# EAGLE design freebus_kopplerplatine (EAGLE 4.16)
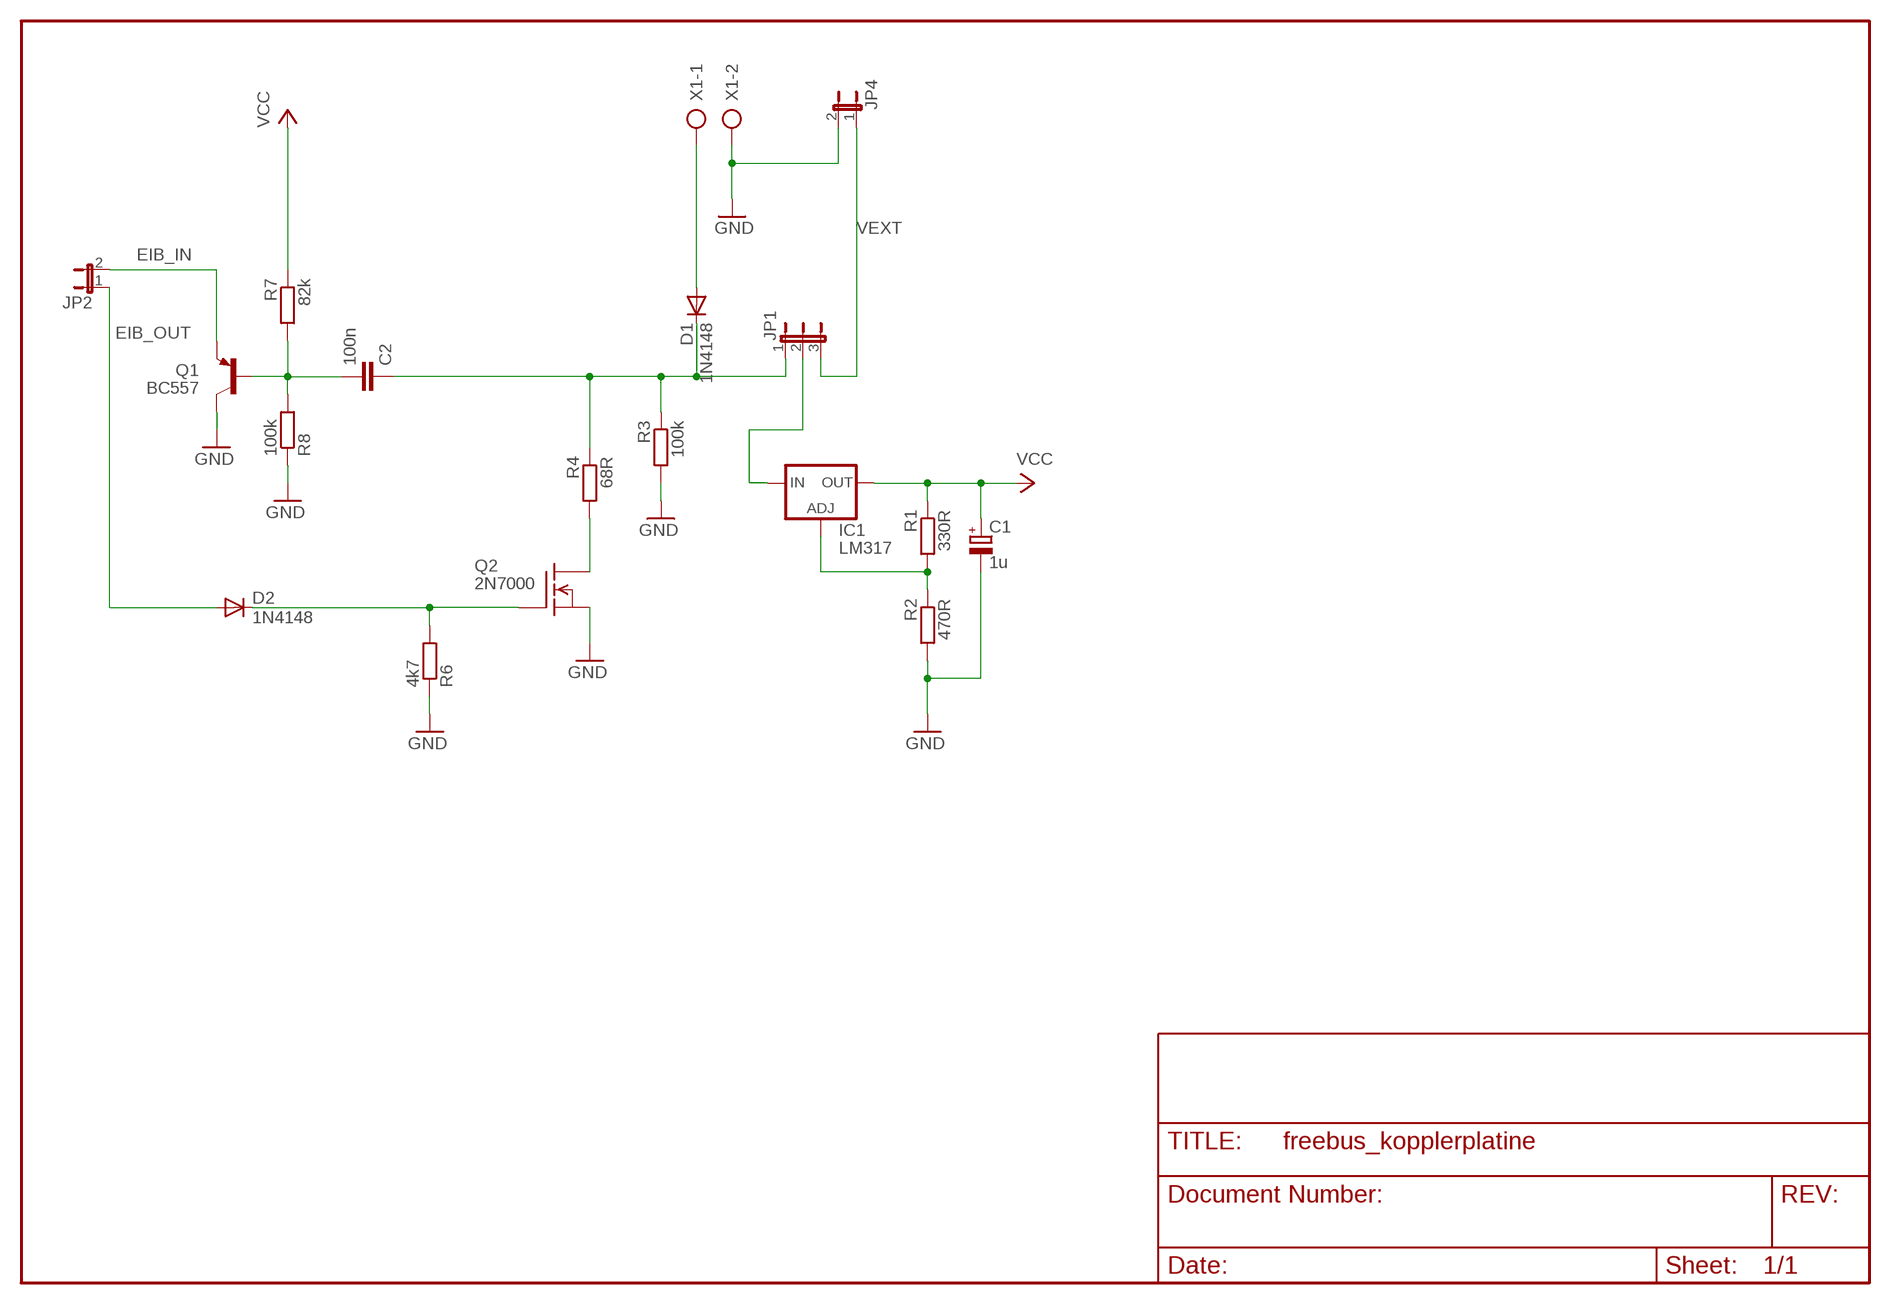
[diagram p0: schematic, sheet 1]

## Parts
C1  1u  CPOL-EUE2-5  [E2-5]
C2  100n  C-EU050-025X075  [C050-025X075]
D1  1N4148  [DO35-10]
D2  1N4148  [DO35-10]
IC1  LM317  LM317L  [317L]
JP1  JP2E  [JP2]
JP2  JP1E  [JP1]
JP4  JP1E  [JP1]
Q1  BC557  [TO92]
Q2  2N7000  VN2222KM  [TO237]
R1  330R  R-EU_0207/10  [0207/10]
R2  470R  R-EU_0207/10  [0207/10]
R3  100k  R-EU_0207/10  [0207/10]
R4  68R  R-EU_0207/10  [0207/10]
R6  4k7  R-EU_0207/10  [0207/10]
R7  82k  R-EU_0207/10  [0207/10]
R8  100k  R-EU_0207/10  [0207/10]
X1  AK500/2  [AK500/2]

## Nets
EIB_IN: JP2.2 Q1.1(E)
EIB_OUT: D2.A JP2.1
GND: C1.- JP4.2 Q1.3(C) Q2.3(S) R2.2 R3.2 R6.1 R8.1 X1.2
N$1: D2.C Q2.2(G) R6.2
N$2: IC1.1(ADJ) R1.2 R2.1
N$3 [supply]: C2.1 D1.C JP1.1 R3.1 R4.1
N$4: D1.A X1.1
N$5 [supply]: Q2.1(D) R4.2
N$6 [supply]: IC1.3(IN) JP1.2
N$7 [supply]: C2.2 Q1.2(B) R7.2 R8.2
VCC: C1.+ IC1.2(OUT) R1.1 R7.1
VEXT [supply]: JP1.3 JP4.1

## Library data of the parts
C1 = rcl:CPOL-EU: POLARIZED CAPACITOR, European symbol
C2 = rcl:C-EU: CAPACITOR, European symbol
D1 D2 = diode:1N4148: DIODE high speed (Philips)
IC1 = v-reg:LM317L: VOLTAGE REGULATOR
JP1 = jumper:JP2E: JUMPER
JP2 JP4 = jumper:JP1E: JUMPER
Q1 = transistor-pnp:BC557: PNP Transistor
Q2 = transistor-fet:VN2222KM: N-Channel Enhancement MOSFET (VMOS); 60V; 0,5A; 7,5Ohm
R1-R4 R6-R8 = rcl:R-EU_: RESISTOR, European symbol
X1 = con-ptr500:AK500/2: CONNECTOR

## Net classes
0 default: width 0.406 mm
1 supply: width 0.406 mm

## Board
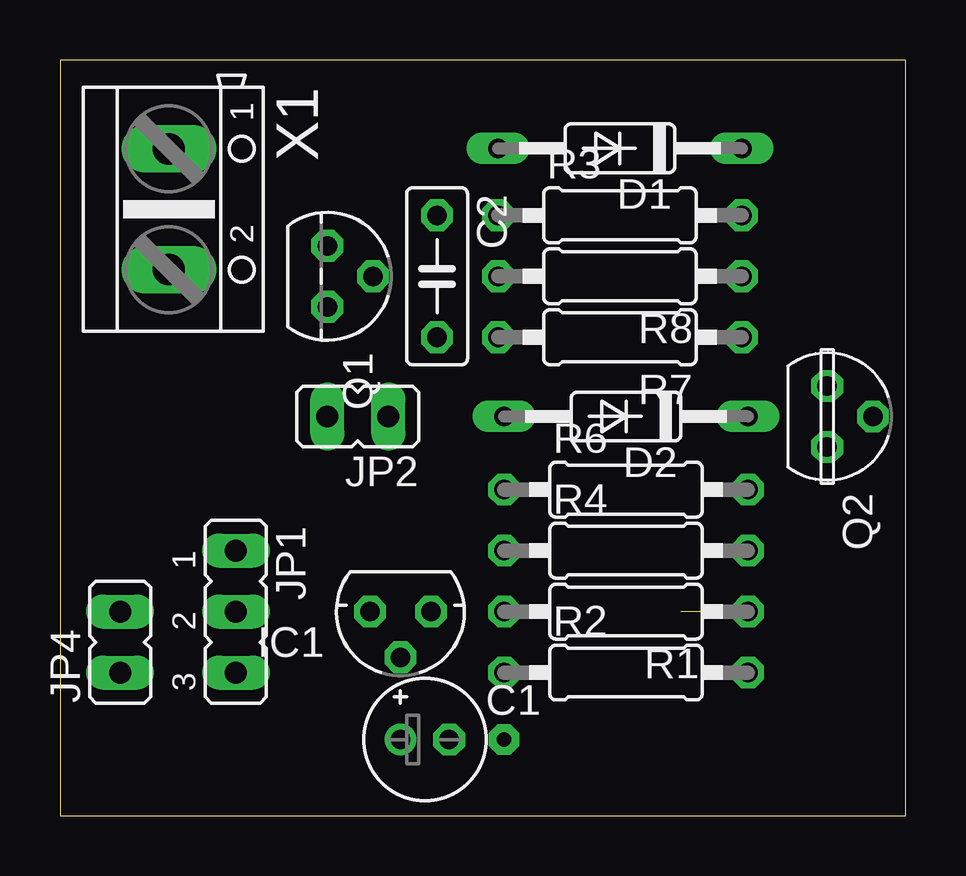
[diagram p1: board, top side]
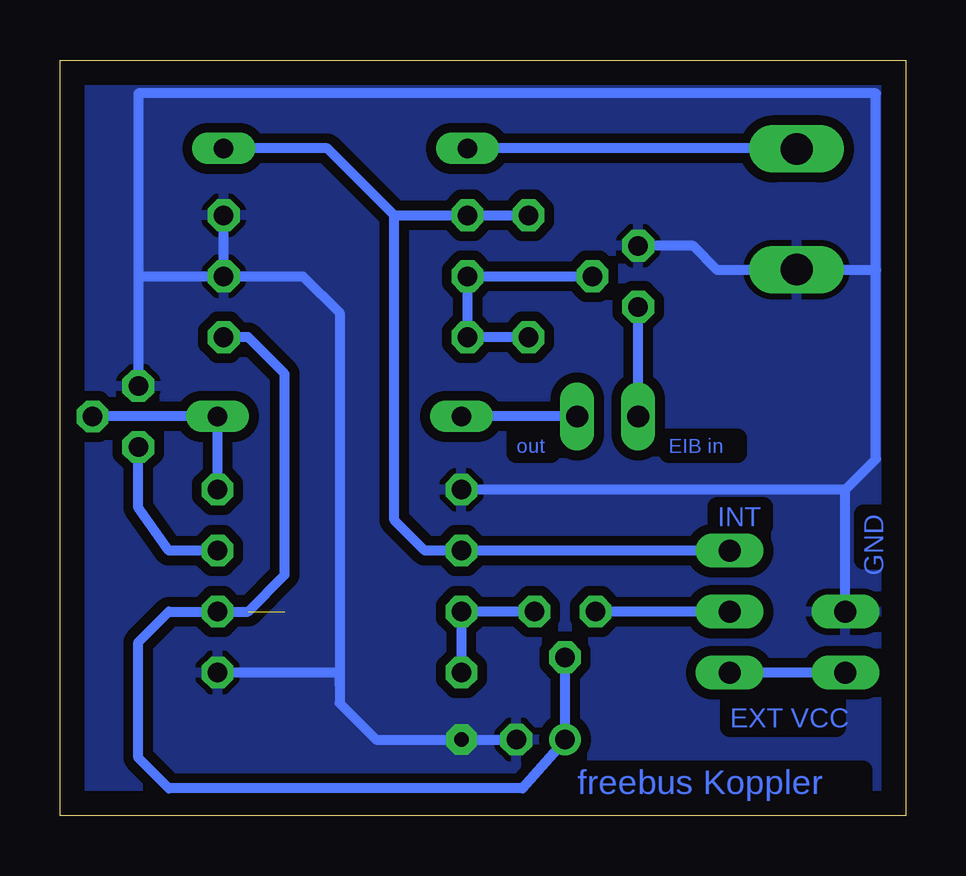
[diagram p2: board, bottom side, seen from below]

Size 35.23 x 31.49 mm. Coordinates in mm from the lower left corner, seen from the top.
Outline: 0,0 35.23,0 35.23,31.49 0,31.49 0,0
Copper layers (1*16): Top 0.035mm / dielectric 1.5mm / Bottom 0.035mm
Design rules "default": minimum track width 10mil, minimum drill 24mil, track to track 16mil, track to pad 16mil, pad to pad 16mil, via to via 8mil, smd to smd 8mil, copper to edge 40mil, drill to drill 8mil, minimum pad ring 10mil, minimum via ring 8mil, stop-mask expansion 4mil, vias tented up to drill 0mil, thermal gap 10mil

### Footprints (pad centres in the part's own frame; a part is rotated, then mirrored left to right if it is on the bottom)
E2-5 = drill 0.813 pad 1.27 round: + -1.016,0 | drill 0.813 pad 1.27 octagon: - 1.016,0
C050-025X075 = drill 0.813 octagon: 1 -2.54,0; 2 2.54,0
DO35-10 = drill 0.813 long: A 5.08,0; C -5.08,0
317L = drill 0.813 octagon: 1 -1.27,0; 2 0,1.905; 3 1.27,0
JP2 = drill 0.914 long: 1 -2.54,0; 2 0,0; 3 2.54,0
JP1 = drill 0.914 long: 1 0,-1.27; 2 0,1.27
TO92 = drill 0.813 octagon: 1 1.27,0; 2 0,1.905; 3 -1.27,0
TO237 = drill 0.813 octagon: 1 1.27,0; 2 0,1.905; 3 -1.27,0
0207/10 = drill 0.813 octagon: 1 -5.08,0; 2 5.08,0
AK500/2 = drill 1.321 long: 1 -2.515,0; 2 2.515,0

### Placement (x,y rotation side)
C1  15.2,3.17 0 top
C2  15.71,22.47 270 top
D1  23.33,27.81 180 top
D2  23.58,16.63 180 top
IC1  14.19,8.5 180 top
JP1  7.33,8.5 270 top
JP2  12.41,16.63 90 top
JP4  2.5,7.23 0 top
Q1  11.14,22.47 270 top
Q2  31.97,16.63 270 top
R1  23.58,8.5 180 top
R2  23.58,5.96 0 top
R3  23.33,25.01 0 top
R4  23.58,11.04 0 top
R6  23.58,13.58 0 top
R7  23.33,19.93 180 top
R8  23.33,22.47 180 top
X1  4.53,25.27 270 top

### Tracks (layer width: path | path; a pad name or v marks a point on that pad's centre or on a via)
EIB_IN
  Bottom 0.406: JP2.2 Q1.1
EIB_OUT
  Bottom 0.406: JP2.1 D2.A
GND  (via drill 0.6 pad 1.27)
  Bottom 0.406: R2.2 23.58,5.96 23.58,5.46 | R8.1 R3.2 | X1.2 5.04,22.73 | 2.5,13.58 1.23,14.85 1.23,22.73 | 1.23,22.73 1.23,30.09 31.97,30.09 31.97,22.47 | JP4.2 2.5,13.58 | X1.2 4.53,22.73 1.23,22.73 | 31.97,22.47 Q2.3 | 31.97,22.47 R8.1 | Q1.3 8.85,23.74 7.84,22.73 4.79,22.73 4.76,22.75 X1.2 | C1.- v18.5,3.17 18.5,2.92 18.76,3.17 22.06,3.17 23.58,4.69 23.58,5.46 | 2.5,13.58 R6.1 | R8.1 25.11,22.47 23.58,20.95 23.58,5.46
  pour Bottom: -0.04,31.62 -0.04,0.12 37.55,0.12 37.81,-0.13 37.81,31.62
N$1
  Bottom 0.406: Q2.2 D2.C R6.2
N$2
  Bottom 0.406: R1.2 R2.1 R1.2 | IC1.1 R1.2
N$3
  Bottom 0.406: C2.1 R3.1 21.3,25.01 | 21.3,25.01 21.3,12.31 20.03,11.04 R4.1 | D1.C 24.09,27.81 21.3,25.01 | R4.1 18.76,11.04 | JP1.1 R4.1
N$4
  Bottom 0.406: X1.1 4.53,27.81 D1.A
N$5
  Bottom 0.406: R4.2 30.7,11.04 31.97,12.82 Q2.1
N$6
  Bottom 0.406: JP1.2 IC1.3
N$7
  Bottom 0.406: C2.2 R7.2 R8.2 Q1.2
VCC  (1 unrouted)
  Bottom 0.406: IC1.2 C1.+ 15.96,1.14 30.7,1.14 31.97,2.41 31.97,7.23 30.7,8.5 R1.1 27.39,8.5 25.87,10.03 25.87,18.41 27.39,19.93 R7.1
VEXT
  Bottom 0.406: JP4.1 JP1.3

### Text on the board
Bottom: EIB in | out | GND | INT | EXT VCC | freebus Koppler